# EAGLE design biosphereMonitor (EAGLE 9.6.2)

## Sheet 1 of 5: Microcontroller
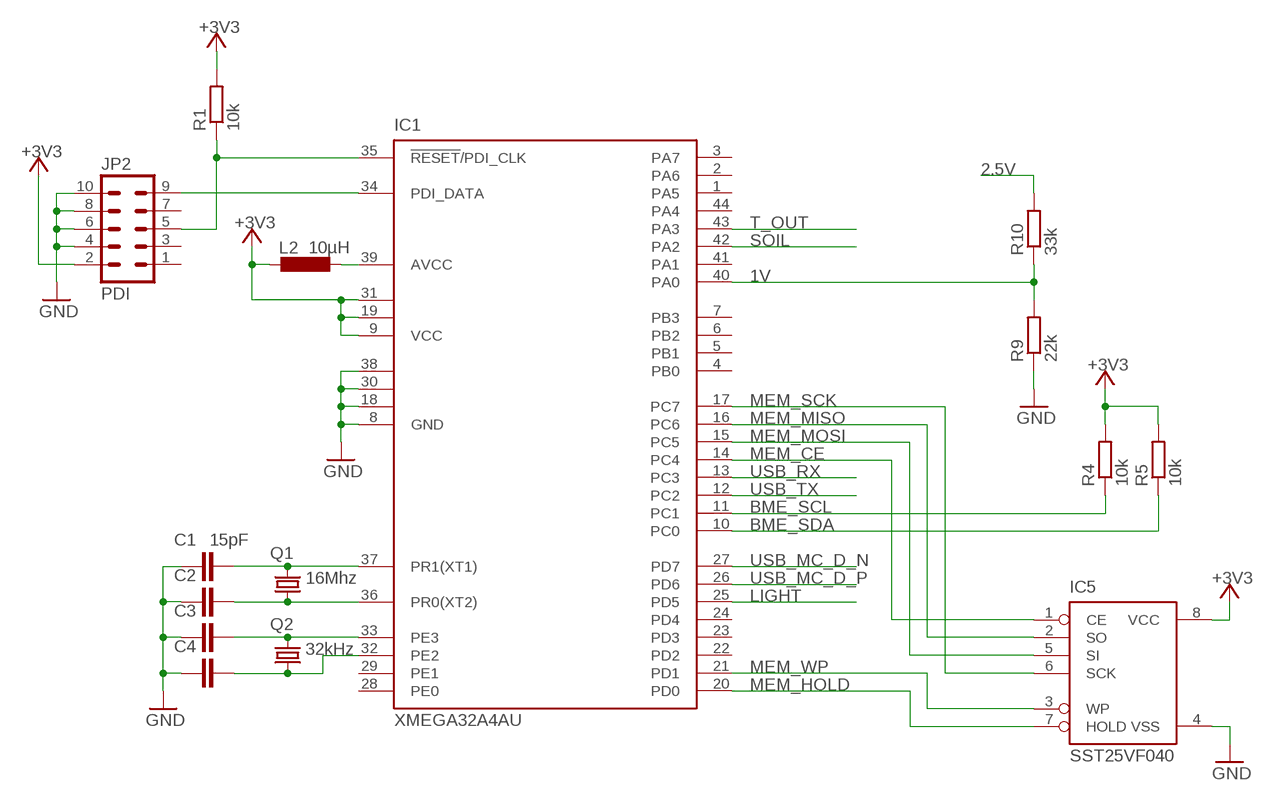
[diagram p0: schematic, sheet 1]

### Parts
C1  15pF  C-EUC0805  [C0805]
C2  15pF  C-EUC0805  [C0805]
C3  15pF  C-EUC0805  [C0805]
C4  15pF  C-EUC0805  [C0805]
IC1  XMEGA32A4AU  XMEGA16A4A  [TQFP44]
IC5  SST25VF040  SST25VF040SO08W  [SO08-208]
JP2  PDI  ML10L  [ML10L]
L2  10µH  L-EUL2012C  [L2012C]
Q1  16Mhz  CRYSTALSM49  [SM49]
Q2  32kHz  MQ_CRYSTALMS1V  [MS1V]
R1  10k  R-EU_R0805  [R0805]
R4  10k  R-EU_R0805  [R0805]
R5  10k  R-EU_R0805  [R0805]
R9  22k  R-EU_R0805  [R0805]
R10  33k  R-EU_R0805  [R0805]

### Nets
1V: IC1.40(PA0) R9.2 R10.1
2.5V: R10.2 ; also sheet 2
+3V3: IC1.9(VCC) IC1.19(VCC1) IC1.31(VCC2) IC5.8(VCC) JP2.2 L2.1 R1.2 R4.2 R5.2 ; also sheet 2,3,5
AVCC: IC1.39(AVCC) L2.2
BME_SCL: IC1.11(PC1) R4.1 ; also sheet 5
BME_SDA: IC1.10(PC0) R5.1 ; also sheet 5
GND: C1.1 C2.1 C3.1 C4.1 IC1.8(GND) IC1.18(GND1) IC1.30(GND2) IC1.38(GND3) IC5.4(VSS) JP2.4 JP2.6 JP2.8 JP2.10 R9.1 ; also sheet 2,3,4,5
LIGHT: IC1.25(PD5) ; also sheet 4
MEM_CE: IC1.14(PC4) IC5.1(CE)
MEM_HOLD: IC1.20(PD0) IC5.7(HOLD)
MEM_MISO: IC1.16(PC6) IC5.2(SO)
MEM_MOSI: IC1.15(PC5) IC5.5(SI)
MEM_SCK: IC1.17(PC7) IC5.6(SCK)
MEM_WP: IC1.21(PD1) IC5.3(WP)
N$1: IC1.35(!RESET!/PDI_CLK) JP2.5 R1.1
N$2: IC1.34(PDI_DATA) JP2.9
N$3: C1.2 IC1.37(PR1(XT1)) Q1.2
N$4: C2.2 IC1.36(PR0(XT2)) Q1.1
N$5: C3.2 IC1.33(PE3) Q2.Q1
N$6: C4.2 IC1.32(PE2) Q2.Q2
SOIL: IC1.42(PA2) ; also sheet 5
T_OUT: IC1.43(PA3) ; also sheet 4
USB_MC_D_N: IC1.27(PD7) ; also sheet 3
USB_MC_D_P: IC1.26(PD6) ; also sheet 3
USB_RX: IC1.13(PC3) ; also sheet 3
USB_TX: IC1.12(PC2) ; also sheet 3
Unconnected: IC1.1(PA5) IC1.2(PA6) IC1.3(PA7) IC1.4(PB0) IC1.5(PB1) IC1.6(PB2) IC1.7(PB3) IC1.22(PD2) IC1.23(PD3) IC1.24(PD4) IC1.28(PE0) IC1.29(PE1) IC1.41(PA1) IC1.44(PA4) JP2.1 JP2.3 JP2.7

## Sheet 2 of 5: Power
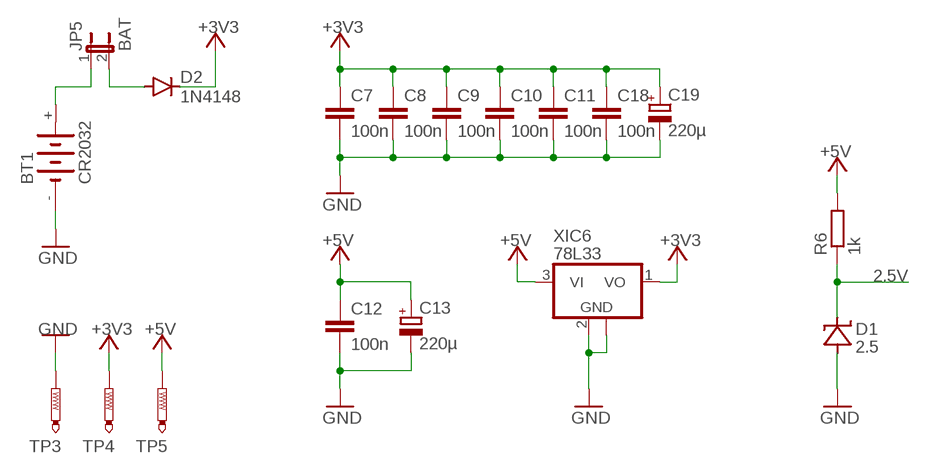
[diagram p1: schematic, sheet 2]

### Parts
BT1  CR2032  [CR2032]
C7  100n  C-EUC0805  [C0805]
C8  100n  C-EUC0805  [C0805]
C9  100n  C-EUC0805  [C0805]
C10  100n  C-EUC0805  [C0805]
C11  100n  C-EUC0805  [C0805]
C12  100n  C-EUC0805  [C0805]
C13  220µ  CPOL-EUG  [PANASONIC_G]
C18  100n  C-EUC0805  [C0805]
C19  220µ  CPOL-EUG  [PANASONIC_G]
D1  2.5  LM4040  [SOT23]
D2  1N4148  DIODE-MINIMELF  [MINIMELF]
JP5  BAT  JP1E  [JP1]
R6  1k  R-EU_R0805  [R0805]
TP3  PTR1B2,54  [B2,54]
TP4  PTR1B2,54  [B2,54]
TP5  PTR1B2,54  [B2,54]
XIC6  78L33  78L05F  [SOT89]

### Nets
2.5V: D1.1(C) R6.1 ; also sheet 1
+3V3: C7.2 C8.2 C9.2 C10.2 C11.2 C18.2 C19.+ D2.C TP4.TP XIC6.1(VO) ; also sheet 1,3,5
+5V: C12.2 C13.+ R6.2 TP5.TP XIC6.3(VI) ; also sheet 3,4,5
GND: BT1.- C7.1 C8.1 C9.1 C10.1 C11.1 C12.1 C13.- C18.1 C19.- D1.2(A) TP3.TP XIC6.2(GND) XIC6.2@1(GND) ; also sheet 1,3,4,5
N$26: BT1.+ JP5.1
N$27: D2.A JP5.2

## Sheet 3 of 5: USB UART
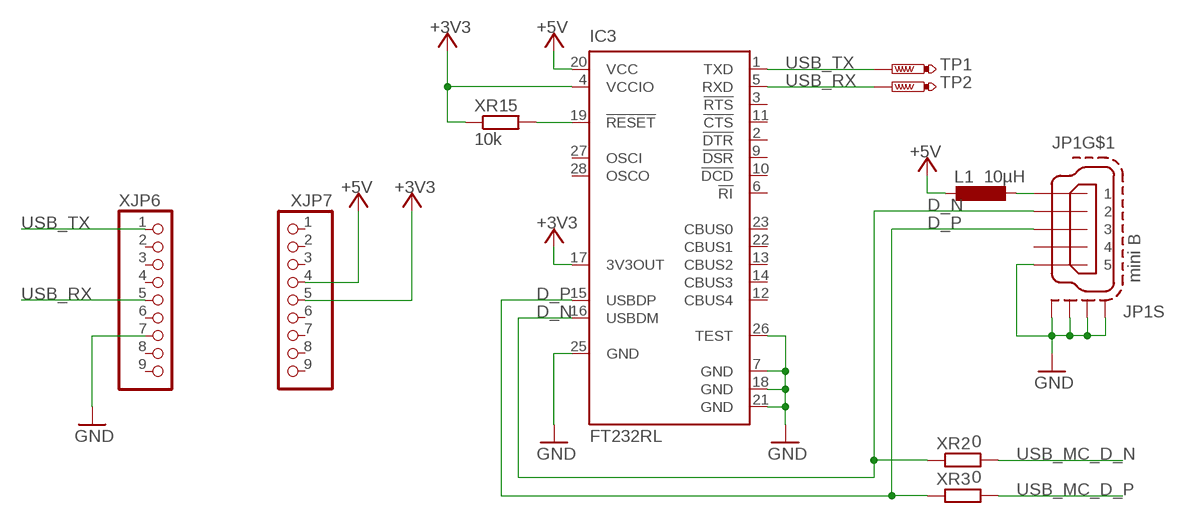
[diagram p2: schematic, sheet 3]

### Parts
IC3  FT232RL  [SSOP28]
JP1  mini B  MINI-USB-SCHIELD-32005-301  [32005-301]
L1  10µH  L-EUL2012C  [L2012C]
TP1  PTR1B2,54  [B2,54]
TP2  PTR1B2,54  [B2,54]
XJP6  PINHD-1X9  [1X09]
XJP7  PINHD-1X9  [1X09]
XR2  0  R-EU_R0805  [R0805]
XR3  0  R-EU_R0805  [R0805]
XR15  10k  R-EU_R0805  [R0805]

### Nets
+3V3: IC3.4(VCCIO) IC3.17(3V3OUT) XJP7.5 XR15.1 ; also sheet 1,2,5
+5V: IC3.20(VCC) L1.1 XJP7.4 ; also sheet 2,4,5
D_N: IC3.16(USBDM) JP1.2 XR2.1
D_P: IC3.15(USBDP) JP1.3 XR3.1
GND: IC3.7(GND) IC3.18(GND) IC3.21(GND) IC3.25(GND) IC3.26(TEST) JP1.5 JP1.M1(S:S1) JP1.M2(S:S2) JP1.M3(S:S3) JP1.M4(S:S4) XJP6.7 ; also sheet 1,2,4,5
N$7: JP1.1 L1.2
N$28: IC3.19(!RESET) XR15.2
USB_MC_D_N: XR2.2 ; also sheet 1
USB_MC_D_P: XR3.2 ; also sheet 1
USB_RX: IC3.5(RXD) TP2.TP XJP6.5 ; also sheet 1
USB_TX: IC3.1(TXD) TP1.TP XJP6.1 ; also sheet 1
Unconnected: IC3.2(!DTR) IC3.3(!RTS) IC3.6(!RI) IC3.9(!DSR) IC3.10(!DCD) IC3.11(!CTS) IC3.12(CBUS4) IC3.13(CBUS2) IC3.14(CBUS3) IC3.22(CBUS1) IC3.23(CBUS0) IC3.27(OSCI) IC3.28(OSCO) JP1.4 XJP6.2 XJP6.3 XJP6.4 XJP6.6 XJP6.8 XJP6.9 XJP7.1 XJP7.2 XJP7.3 XJP7.6 XJP7.7 XJP7.8 XJP7.9

## Sheet 4 of 5: Outside Sensors
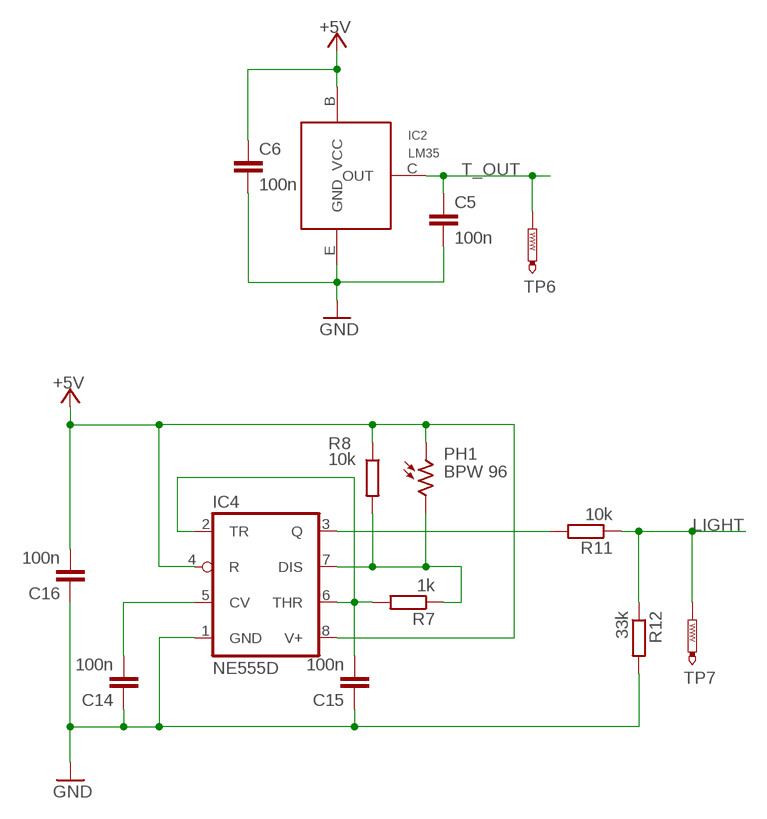
[diagram p3: schematic, sheet 4]

### Parts
C5  100n  C-EUC0805  [C0805]
C6  100n  C-EUC0805  [C0805]
C14  100n  C-EUC0805  [C0805]
C15  100n  C-EUC0805  [C0805]
C16  100n  C-EUC0805  [C0805]
IC2  LM35  [TO92-BCE]
IC4  NE555D  [SO08]
PH1  BPW 96  A1050_13  [T0-46-A10XX]
R7  1k  R-EU_R0805  [R0805]
R8  10k  R-EU_R0805  [R0805]
R11  10k  R-EU_R0805  [R0805]
R12  33k  R-EU_R0805  [R0805]
TP6  PTR1B2,54  [B2,54]
TP7  PTR1B2,54  [B2,54]

### Nets
+5V: C6.2 C16.1 IC2.B(VCC) IC4.4(R) IC4.8(V+) PH1.1 R8.1 ; also sheet 2,3,5
GND: C5.1 C6.1 C14.2 C15.2 C16.2 IC2.E(GND) IC4.1(GND) R12.2 ; also sheet 1,2,3,5
LIGHT: R11.1 R12.1 TP7.TP ; also sheet 1
N$21: IC4.7(DIS) PH1.2 R7.1 R8.2
N$22: C14.1 IC4.5(CV)
N$23: C15.1 IC4.2(TR) IC4.6(THR) R7.2
N$24: IC4.3(Q) R11.2
T_OUT: C5.2 IC2.C(OUT) TP6.TP ; also sheet 1

## Sheet 5 of 5: Inside Sensors
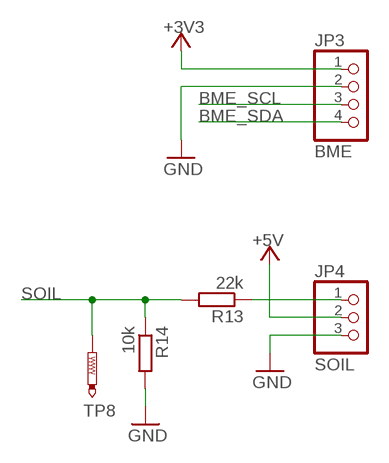
[diagram p4: schematic, sheet 5]

### Parts
JP3  BME  PINHD-1X4  [1X04]
JP4  SOIL  PINHD-1X3  [1X03]
R13  22k  R-EU_R0805  [R0805]
R14  10k  R-EU_R0805  [R0805]
TP8  PTR1B2,54  [B2,54]

### Nets
+3V3: JP3.1 ; also sheet 1,2,3
+5V: JP4.2 ; also sheet 2,3,4
BME_SCL: JP3.3 ; also sheet 1
BME_SDA: JP3.4 ; also sheet 1
GND: JP3.2 JP4.3 R14.2 ; also sheet 1,2,3,4
N$25: JP4.1 R13.1
SOIL: R13.2 R14.1 TP8.TP ; also sheet 1

## Library data of the parts
BT1 = Tjarks_Bauteile (1):CR2032
C1-C12 C14-C16 C18 = rcl:C-EU: CAPACITOR, European symbol; SPICEPREFIX: C
C13 C19 = rcl:CPOL-EU: POLARIZED CAPACITOR, European symbol; SPICEPREFIX: C
D1 = Tjarks_Bauteile (1):LM4040
D2 = diode:DIODE-: DIODE
IC1 = atmel:XMEGA16A4: MICROCONTROLLER Features High-performance, Low-power 8/16-bit AVR XMEGA Microcontroller Non-Volatile Program and Data Memories - 16 KB - 128 KB of In-System Self-Programmable Flash - 4 KB - 8 KB Boot Code Section with Independent Lock Bits - 1 KB - 2 KB EEPROM - 2 KB - 8 KB Internal SRAM Peripheral Features - Four-channel DMA Controller with support for external requests - Eight-channel Event System - Five 16-bit Timer/Counters Three Timer/Counters with 4 Output Compare or Input Capture channels Two Timer/Counters with 2 Output Compare or Input Capture channels High-Resolution Extensions on all Timer/Counters Advanced Waveform Extension on one Timer/Counter - Five USARTs IrDA Extension on one USART - Two Two-Wire Interfaces with dual address match (I2C and SMBus compatible) - Two SPIs (Serial Peripheral Interfaces) peripherals - AES and DES Crypto Engine - 16-bit Real Time Counter with Separate Oscillator - One Twelve-channel, 12-bit, 2 Msps Analog to Digital Converter - One Two-channel, 12-bit, 1 Msps Digital to Analog Converter - Two Analog Comparators with Window compare function - External Interrupts on all General Purpose I/O pins - Programmable Watchdog Timer with Separate On-chip Ultra Low Power Oscillator Special Microcontroller Features - Power-on Reset and Programmable Brown-out Detection - Internal and External Clock Options with PLL - Programmable Multi-level Interrupt Controller - Sleep Modes: Idle, Power-down, Standby, Power-save, Extended Standby - Advanced Programming, Test and Debugging Interfaces PDI (Program and Debug Interface) for programming, test and debugging I/O and Packages - 34 Programmable I/O Lines - 44 - lead TQFP - 44 - pad VQFN/QFN - 49 - ball VFBGA Operating Voltage - 1.6 - 3.6V Speed performance - 0 - 12 MHz @ 1.6 - 3.6V - 0 - 32 MHz @ 2.7 - 3.6V Drawn by Dipl.-Ing. (FH) Robert Siegler Created: 27.05.09; OC_FARNELL: unknown; OC_NEWARK: unknown
IC2 = Tjarks_Bauteile (1):LM35
IC3 = ftdichip:FT232R: Source: http://www.ftdichip.com/Documents/DataSheets/DS_FT232R_v104.pdf; MPN: FT232RL; OC_FARNELL: 1146032; OC_NEWARK: 91K9918
IC4 = linear:*555: TIMER
IC5 = Tjarks_Bauteile (1):SST25VF040
JP1 = con-cypressindustries:MINI-USB-SCHIELD-: MINI USB-B Conector Source: www.cypressindustries.com; OC_FARNELL: unknown; OC_NEWARK: unknown
JP2 = con-harting-ml:ML10: HARTING; OC_FARNELL: unknown; OC_NEWARK: unknown
JP3 = pinhead:PINHD-1X4: PIN HEADER
JP4 = pinhead:PINHD-1X3: PIN HEADER
JP5 = jumper:JP1E: JUMPER
L1 L2 = rcl:L-EU: INDUCTOR, European symbol; SPICEPREFIX: L
PH1 = photo-elements:A10: Sensor Robust Light Sensing Applications Outdoor Light Sensing Application Source: http://optoelectronics.perkinelmer.com/content/Datasheets/DTS_PhotocellsA1050.pdf
Q1 = crystal:CRYSTAL: CRYSTAL; OC_FARNELL: unknown; OC_NEWARK: unknown
Q2 = Tjarks_Bauteile (1):MQ_CRYSTAL
R1 R4-R14 XR2 XR3 XR15 = rcl:R-EU_: RESISTOR, European symbol; SPICEPREFIX: R
TP1-TP8 = testpad:PTR1: TEST PIN
XIC6 = linear:78L*: POSITOIV-VOLTAGE REGULATORS Output up to 100 mA Source: Datasheet <http://focus.ti.com/lit/ds/symlink/ua78l05.pdf>
XJP6 XJP7 = pinhead:PINHD-1X9: PIN HEADER

## Board
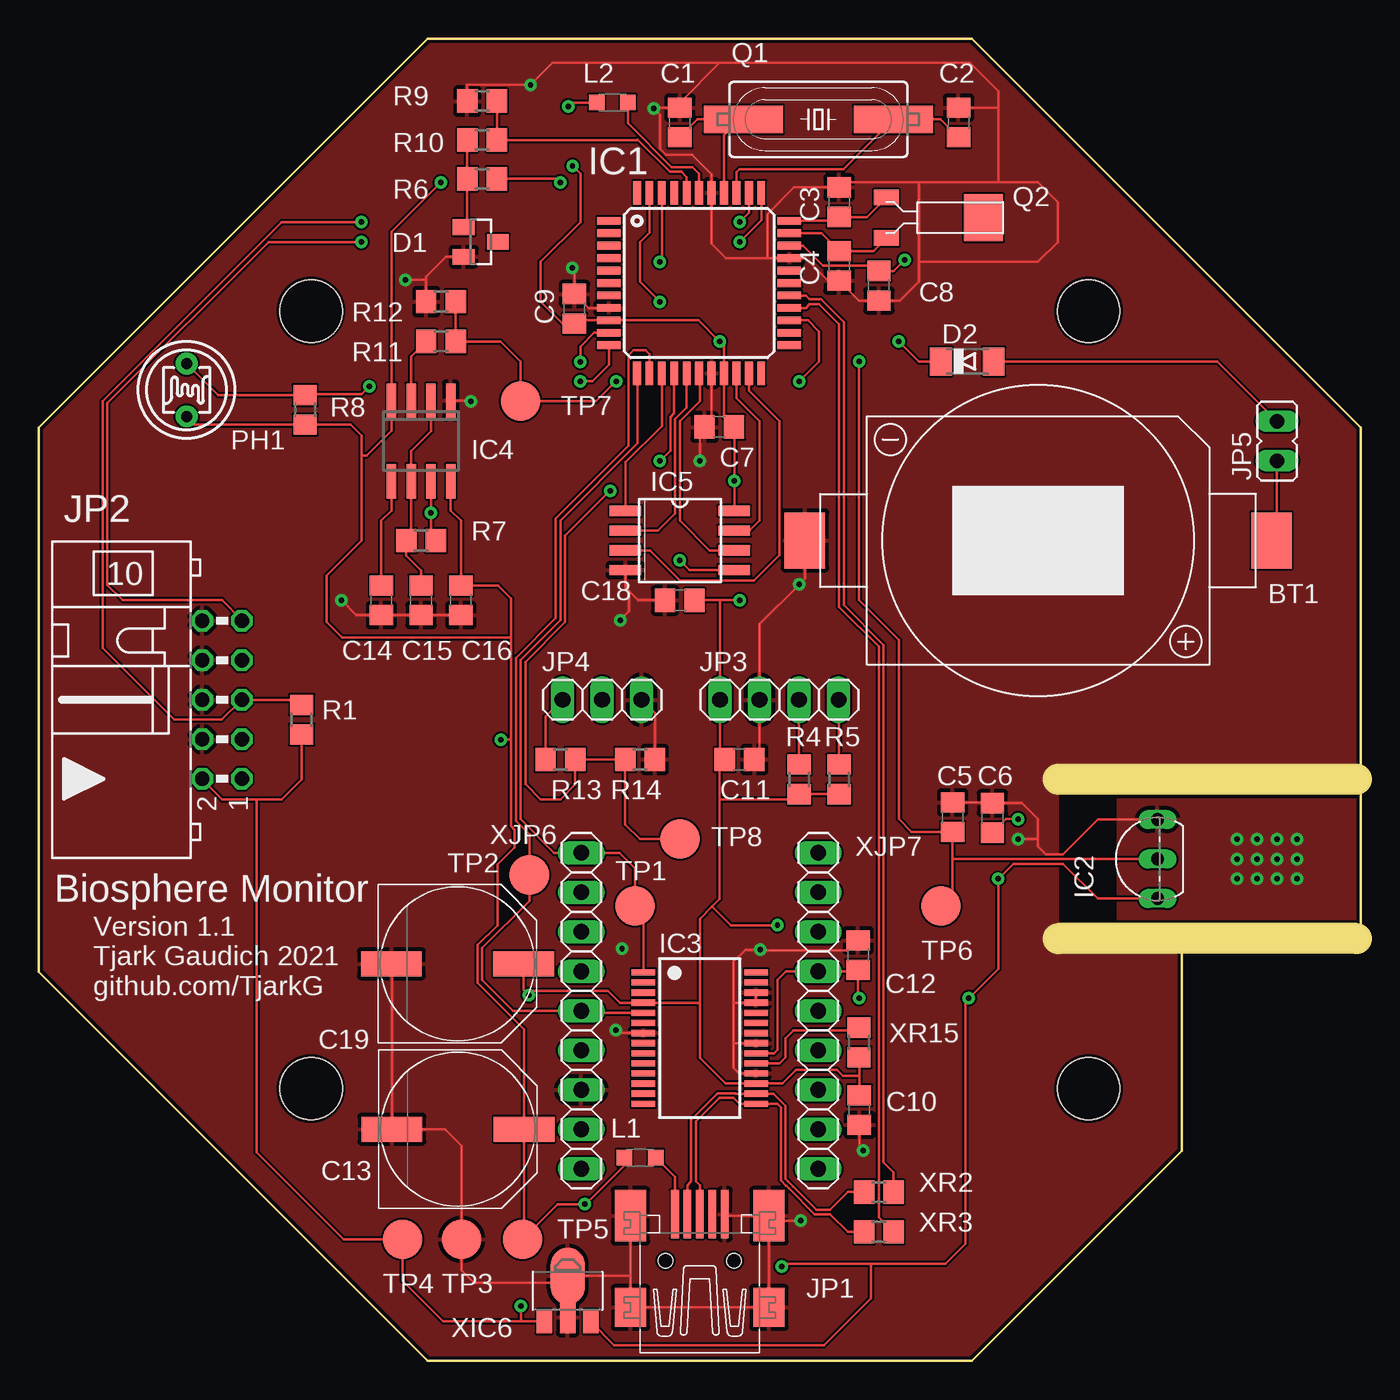
[diagram p5: board, top side]
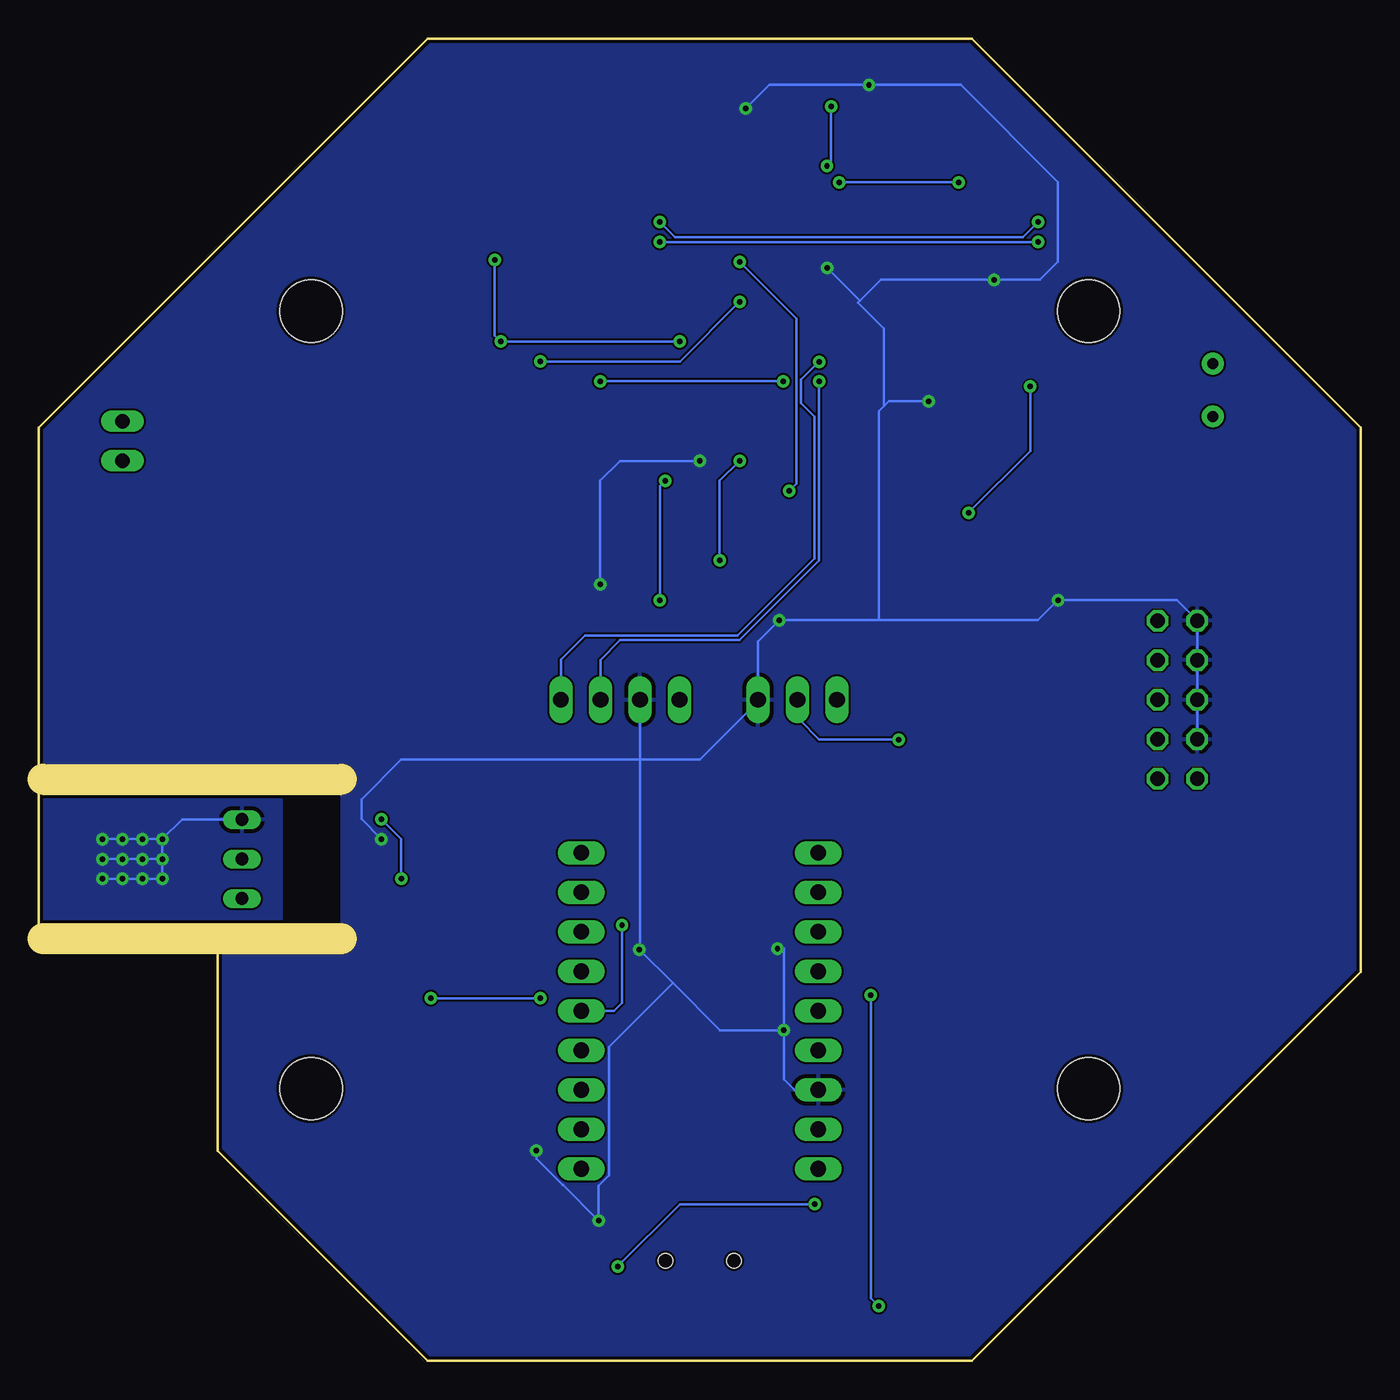
[diagram p6: board, bottom side, seen from below]

Size 85 x 85 mm. Coordinates in mm from the lower left corner, seen from the top.
Outline: 0,60 25,85 60,85 85,60 85,27 73.5,27 73.5,13.5 60,0 25,0 0,25 0,60
Copper layers (1*16): Top 0.035mm / dielectric 1.5mm / Bottom 0.035mm
Design rules "JLCPCB *": minimum track width 5mil, minimum drill 0.2mm, track to track 5mil, track to pad 0.2mm, pad to pad 5mil, via to via 10mil, smd to smd 5mil, copper to edge 0.2mm, drill to drill 0.5mm, minimum pad ring 0.13mm, minimum via ring 0.225mm, stop-mask expansion 0.05mm, vias tented up to drill 0mil, thermal gap 10mil
Holes 4 mm at 17.5,67.5 67.5,67.5 67.5,17.5 17.5,17.5
Milling: 2 lines

### Footprints (pad centres in the part's own frame; a part is rotated, then mirrored left to right if it is on the bottom)
CR2032 = smd 2.6 x 3.6: + 15,0; - -15,0
C0805 = smd 1.3 x 1.5: 1 -0.95,0; 2 0.95,0
PANASONIC_G = smd 3.9 x 1.6: + 4.25,0; - -4.25,0
SOT23 = smd 1 x 1.4: 1 -0.95,-1.1; 2 0.95,-1.1; 3 0,1.1
MINIMELF = smd 1.4 x 1.8: A 1.7,0; C -1.7,0
TQFP44 = smd 1.5 x 0.5: 1 -5.8,4; 2 -5.8,3.2; 3 -5.8,2.4; 4 -5.8,1.6; 5 -5.8,0.8; 6 -5.8,0; 7 -5.8,-0.8; 8 -5.8,-1.6; 9 -5.8,-2.4; 10 -5.8,-3.2; 11 -5.8,-4; 23 5.8,-4; 24 5.8,-3.2; 25 5.8,-2.4; 26 5.8,-1.6; 27 5.8,-0.8; 28 5.8,0; 29 5.8,0.8; 30 5.8,1.6; 31 5.8,2.4; 32 5.8,3.2; 33 5.8,4 | smd 0.5 x 1.5: 12 -4,-5.8; 13 -3.2,-5.8; 14 -2.4,-5.8; 15 -1.6,-5.8; 16 -0.8,-5.8; 17 0,-5.8; 18 0.8,-5.8; 19 1.6,-5.8; 20 2.4,-5.8; 21 3.2,-5.8; 22 4,-5.8; 34 4,5.8; 35 3.2,5.8; 36 2.4,5.8; 37 1.6,5.8; 38 0.8,5.8; 39 0,5.8; 40 -0.8,5.8; 41 -1.6,5.8; 42 -2.4,5.8; 43 -3.2,5.8; 44 -4,5.8
TO92-BCE = drill 0.813 long: B -2.54,0; C 0,0; E 2.54,0
SSOP28 = smd 0.4 x 1.5: 1 -4.225,-3.625; 2 -3.575,-3.625; 3 -2.925,-3.625; 4 -2.275,-3.625; 5 -1.625,-3.625; 6 -0.975,-3.625; 7 -0.325,-3.625; 8 0.325,-3.625; 9 0.975,-3.625; 10 1.625,-3.625; 11 2.275,-3.625; 12 2.925,-3.625; 13 3.575,-3.625; 14 4.225,-3.625; 15 4.225,3.625; 16 3.575,3.625; 17 2.925,3.625; 18 2.275,3.625; 19 1.625,3.625; 20 0.975,3.625; 21 0.325,3.625; 22 -0.325,3.625; 23 -0.975,3.625; 24 -1.625,3.625; 25 -2.275,3.625; 26 -2.925,3.625; 27 -3.575,3.625; 28 -4.225,3.625
SO08 = smd 0.6 x 2.2: 1 -1.905,-2.6; 2 -0.635,-2.6; 3 0.635,-2.6; 4 1.905,-2.6; 5 1.905,2.6; 6 0.635,2.6; 7 -0.635,2.6; 8 -1.905,2.6
SO08-208 = smd 0.66 x 2.032: 1 -1.905,-3.498; 2 -0.635,-3.498; 3 0.635,-3.498; 4 1.905,-3.498; 5 1.905,3.498; 6 0.635,3.498; 7 -0.635,3.498; 8 -1.905,3.498
32005-301 = smd 3.1 x 0.5: 1 3,1.6; 2 3,0.8; 3 3,0; 4 3,-0.8; 5 3,-1.6 | smd 2.5 x 2: M1 -3,-4.45; M2 -3,4.45 | smd 3.3 x 2: M3 2.9,4.45; M4 2.9,-4.45 | hole 0.9: 0,2.2; 0,-2.2
ML10L = drill 0.914 octagon: 1 -5.08,-1.27; 2 -5.08,1.27; 3 -2.54,-1.27; 4 -2.54,1.27; 5 0,-1.27; 6 0,1.27; 7 2.54,-1.27; 8 2.54,1.27; 9 5.08,-1.27; 10 5.08,1.27
1X04 = drill 1.016 long: 1 -3.81,0; 2 -1.27,0; 3 1.27,0; 4 3.81,0
1X03 = drill 1.016 long: 1 -2.54,0; 2 0,0; 3 2.54,0
JP1 = drill 0.914 long: 1 0,-1.27; 2 0,1.27
L2012C = smd 1 x 1: 1 -1,0; 2 1,0
T0-46-A10XX = drill 0.7 pad 1.4: 1 -1.7,0; 2 1.7,0
SM49 = smd 5.08 x 1.778: 1 -4.826,0; 2 4.826,0
MS1V = smd 2.5 x 3: NC -6.25,0 | smd 1.6 x 1: Q1 0,-1.3; Q2 0,1.3
R0805 = smd 1.3 x 1.5: 1 -0.95,0; 2 0.95,0
B2,54 = smd 2.54 x 2.54: TP 0,0
SOT89 = smd 1 x 1.5: 1 -1.499,-1.981; 3 1.499,-1.981 | smd 1 x 2: 2 0,-1.727 | smd 2.2 x 3.7: 2@1 0,0.94
1X09 = drill 1.016 long: 1 -10.16,0; 2 -7.62,0; 3 -5.08,0; 4 -2.54,0; 5 0,0; 6 2.54,0; 7 5.08,0; 8 7.62,0; 9 10.16,0

### Placement (x,y rotation side)
BT1  64.26,52.74 0 top
C1  41.22,79.62 270 top
C2  59.14,79.62 270 top
C3  51.46,74.5 270 top
C4  51.46,70.4 90 top
C5  58.76,34.95 270 top
C6  61.32,34.9 270 top
C7  43.75,60.04 0 top
C8  54.02,69.12 90 top
C9  34.44,67.65 270 top
C10  52.76,16.11 90 top
C11  45.06,38.66 180 top
C12  52.68,26.08 270 top
C13  26.95,14.88 0 top
C14  22.02,48.9 270 top
C15  24.58,48.9 270 top
C16  27.14,48.9 270 top
C18  41.22,48.9 0 top
C19  26.92,25.52 0 top
D1  28.42,71.94 270 top
D2  59.7,64.26 0 top
IC1  42.46,69.3 0 top
IC2  71.94,32.26 90 top
IC3  42.5,20.74 270 top
IC4  24.58,59.14 180 top
IC5  41.22,52.74 270 top
JP1  42.5,6.42 90 top
JP2  11.78,42.5 90 top
JP3  47.62,42.5 0 top
JP4  36.22,42.5 0 top
JP5  79.62,59.14 0 top
L1  38.66,13.06 0 top
L2  36.88,80.9 0 top
PH1  9.5,62.42 90 top
Q1  50.13,79.82 180 top
Q2  54.5,73.5 180 top
R1  16.9,41.22 270 top
R4  48.9,37.38 270 top
R5  51.46,37.38 270 top
R6  28.5,76 0 top
R7  24.58,52.74 180 top
R8  17.12,61.14 90 top
R9  28.5,81 0 top
R10  28.5,78.5 180 top
R11  25.86,65.54 180 top
R12  25.86,68.1 180 top
R13  33.54,38.66 0 top
R14  38.66,38.66 0 top
TP1  38.34,29.23 0 top
TP2  31.54,31.23 0 top
TP3  27.18,7.81 0 top
TP4  23.38,7.81 0 top
TP5  31.1,7.81 0 top
TP6  58.02,29.23 0 top
TP7  30.98,61.7 0 top
TP8  41.22,33.54 0 top
XIC6  34,4.5 0 top
XJP6  34.88,22.5 270 top
XJP7  50.12,22.5 270 top
XR2  54.02,10.84 0 top
XR3  54.02,8.28 0 top
XR15  52.74,20.46 90 top

### Tracks (layer width: path | path; a pad name or v marks a point on that pad's centre or on a via)
1V
  Top 0.152: IC1.40 41.66,76.11 41.32,76.45 40.57,76.45 38.51,78.51 38.5,78.5 R10.1 R9.2
2.5V
  Top 0.152: D1.1 27.55,73.12 R6.1 R10.2
+3V3  (via drill 0.35)
  Top 0.152: JP2.2 10.51,37.37 11.78,36.1 14,36.1 | 14,36.1 15.62,36.1 16.9,37.38 R1.2 | IC1.31 49.14,71.7 50.44,70.4 53.69,70.4 C8.2 54.97,70.07 v55.68,70.79 | R5.2 R4.2 48.57,36.1 43.78,36.1 | 43.78,36.1 43.78,38.33 C11.2 43.81,38.96 JP3.1 43.81,48.87 43.78,48.9 | 43.78,36.1 43.78,29.7 43.29,29.21 | 43.29,29.21 42.5,28.42 42.5,22.92 | 42.5,22.92 42.5,19.46 44.15,17.82 IC3.17 47.81,17.82 48.69,18.69 51.33,18.69 51.72,18.31 52.76,18.31 | 42.5,22.92 42.4,23.02 IC3.4 37.38,23.02 36.61,23.78 31.79,23.78 31.78,23.78 v31.5,23.5 31.17,23.83 C19.+ | 43.78,48.9 v45.06,48.9 | 43.78,48.9 C18.2 | IC5.8 v44.72,56.58 44.72,60.02 C7.2 44.06,60.68 IC1.19 44.06,65.26 v43.78,65.54 42.42,66.9 IC1.9 34.64,66.9 C9.2 33.66,66.7 32.26,68.1 32.26,70.66 34.82,73.22 34.82,76.34 v34.32,76.84 | v55.3,65.54 56.58,64.26 D2.C | L2.1 34.31,80.9 v34.05,80.64 | XIC6.1 31,2.52 | 31,2.52 25.98,2.52 23.38,5.12 TP4.TP 19.59,7.81 14,13.4 14,36.1 | C10.2 52.76,18.31 | 52.76,18.31 52.76,19.49 XR15.1 | v47.5,28 44.5,28 43.29,29.21 | v31,3.5 31,2.52
  Bottom 0.152: v55.68,70.79 55.68,65.92 v55.3,65.54 v43.78,65.54 | v45.06,48.9 45.06,56.24 v44.72,56.58 | v34.05,80.64 34.05,77.11 v34.32,76.84 | XJP7.5 48,22.5 47.5,23 v47.5,28 | v31.5,23.5 31.5,4 v31,3.5
+5V  (via drill 0.35)
  Top 0.152: IC2.B 68.1,29.72 65.86,31.95 62.67,31.95 v61.7,30.98 61.7,25.2 v59.8,23.3 59.58,23.08 59.58,7.5 58.3,6.22 53.5,6.22 | IC4.8 26.48,54.67 27.14,54.02 C16.1 29.52,49.85 30.37,49 30.37,46.5 | PH1.1 10.03,60.19 R8.1 20.05,60.19 20.74,59.5 20.74,58.19 | 20.74,58.19 21.07,58.19 22.68,59.8 IC4.4 22.68,72.59 v25.86,75.78 | 20.74,58.19 20.74,52.74 18.5,50.5 18.5,47.5 19.5,46.5 30.37,46.5 | L1.1 37.66,12.56 35.16,10.06 v35.1,10.06 33.35,10.06 TP5.TP 31.2,7.91 C13.+ 31.2,21.3 28.22,24.28 28.22,26.72 29.5,28 29.5,31.9 30.6,33 30.6,34.14 30.37,34.37 30.37,39.94 | v33.54,75.78 33.32,76 R6.2 | C6.2 62.19,34.82 v62.98,34.82 | v52.74,23.3 52.68,23.36 52.68,25 | 52.68,25 C12.2 | 53.5,6.22 47.94,6.22 v47.78,6.06 | 30.37,46.5 30.37,39.94 | v29.7,39.94 30.37,39.94 | XIC6.3 35.5,2.5 37,1 50.5,1 53.5,4 53.5,6.22 | 52.68,25 52.64,25.04 XJP7.4 48.04,25.04 47.5,24.5 47.5,20 47.27,19.77 IC3.20
  Bottom 0.152: v25.86,75.78 v33.54,75.78 | v62.98,34.82 61.7,33.54 v61.7,30.98 | v59.8,23.3 v52.74,23.3 | v47.78,6.06 43.78,10.06 v35.1,10.06 | JP4.2 36.1,42.38 36.1,41.22 34.82,39.94 v29.7,39.94
AVCC
  Top 0.152: IC1.39 42.46,76.33 42.04,76.75 40.7,76.75 37.88,79.57 L2.2
BME_SCL  (via drill 0.35)
  Top 0.152: R4.1 JP3.3 | v34.82,62.98 35.6,62.98 36.66,64.04 IC1.11
  Bottom 0.152: JP3.3 48.89,45.07 47.62,46.34 39.94,46.34 34.82,51.46 v34.82,62.98
BME_SDA  (via drill 0.35)
  Top 0.152: R5.1 51.46,42.47 JP3.4 | v34.82,64.23 34.82,65.22 35.7,66.1 IC1.10
  Bottom 0.152: JP3.4 51.43,45.09 49.88,46.64 40.07,46.64 35.12,51.59 35.12,60.73 35.98,61.58 35.98,63.1 34.84,64.23 v34.82,64.23
D_N
  Top 0.152: JP1.2 41.7,11.27 41.95,11.52 41.95,15.5 43.61,17.16 43.65,17.16 43.66,17.18 43.9,17.18 | 43.9,17.18 | 43.9,17.18 44.79,17.18 44.8,17.16 IC3.16 47.23,17.16 48,16.39 48,11.7 48.17,11.53 48.18,11.53 48.51,11.2 48.51,11.19 50,9.7 50.88,9.7 52.02,10.84 XR2.1
D_P
  Top 0.152: JP1.3 42.5,11.27 42.25,11.52 42.25,15.37 43.78,16.9 | 43.78,16.9 44.67,16.9 45.05,16.52 IC3.15 47.48,16.52 47.72,16.28 47.72,11.58 48.06,11.25 48.23,11.08 49.88,9.42 50.88,9.42 52.02,8.28 XR3.1 | 43.78,16.9
GND  (via drill 0.35)
  Top 0.152: IC2.E 68.1,34.8 65.86,32.56 64.77,32.56 64.26,33.08 64.26,33.54 | C16.2 C15.2 C14.2 20.41,47.95 v19.46,48.9 | JP1.M4 JP1.M1 JP1.M2 38.05,5.5 | JP1.M4 44.2,9.32 JP1.5 | JP1.M3 38.05,5.5 | IC3.18 45.03,18.46 44.68,18.82 44.68,20.36 | IC3.21 44.73,20.41 44.68,20.36 | IC3.26 IC3.25 44.77,23.02 44.68,22.92 | 44.68,20.36 44.68,22.92 | C5.1 61.27,35.9 C6.1 63.23,35.85 64.26,34.82 64.26,33.54 | 64.26,33.54 v62.98,33.54 | IC3.7 37.27,21.07 v37.1,21.24 | R14.2 39.61,41.65 JP4.3 | C11.1 46.35,39 JP3.2 46.35,47.37 v48.9,49.92 49.26,50.28 BT1.- | C18.1 38.53,48.9 37.96,49.48 | IC5.4 37.72,49.71 37.96,49.48 | 37.96,49.48 37.96,48.2 v37.38,47.62 | R12.2 24.91,69.51 | 24.91,69.51 24.91,69.71 26.19,70.99 D1.2 | 24.91,69.51 v23.56,69.51 | IC1.18 43.26,60.5 C7.1 42.5,59.74 v42.5,57.86 | IC1.8 35.34,67.7 C9.1 34.44,70.28 v34.31,70.28 | IC4.1 27.74,61.74 v27.78,61.7 | 56.58,70.66 56.58,69.38 55.37,68.17 C8.1 52.74,68.17 C4.1 50.75,69.45 49.3,70.9 IC1.30 46.87,70.9 | 56.58,70.66 56.58,75.78 | 56.58,75.78 51.79,75.78 C3.1 48.57,75.45 46.85,73.73 46.85,70.92 46.87,70.9 | 56.58,70.66 64.26,70.66 65.54,71.94 65.54,74.5 64.26,75.78 61.7,75.78 | 61.7,75.78 56.58,75.78 | 43.78,83.46 41.22,80.9 C1.1 39.56,80.57 v39.56,80.52 39.94,80.13 39.94,77.94 40.32,77.56 42,77.56 43.26,76.3 IC1.38 43.26,71.82 44.18,70.9 46.87,70.9 | 43.78,83.46 59.89,83.46 61.7,81.65 61.7,80.52 | 61.7,80.52 61.7,75.78 | C2.1 61.65,80.57 61.7,80.52 | 43.78,83.46 33.04,83.46 v31.62,82.04 27.55,82.04 R9.1 | XIC6.2 34,5 | 34,5 XIC6.2@1 37.99,5.44 38.05,5.5 | C12.1 52.02,26.37 46.43,26.37 v46.38,26.43 45.43,26.43 44.68,25.68 44.68,22.92 | C10.1 52.76,13.74 v53,13.5
  Top 0.152: v49,9 47.27,9 JP1.M4 | 34,5 28,5 27.18,5.82 TP3.TP 27.18,13.82 26.12,14.88 C13.- 22.7,25.49 C19.-
  Bottom 0.152: v37.1,21.24 41.19,21.24 44.22,24.28 | 44.22,24.28 v46.38,26.43 46.35,26.45 46.35,38.66 | 46.35,38.66 JP3.2 | 46.35,38.66 42.5,38.66 38.76,42.4 JP4.3 38.76,46.24 v37.38,47.62 30.98,47.62 | v62.98,33.54 64.26,34.82 64.26,36.1 61.7,38.66 46.35,38.66 | 30.98,47.62 20.74,47.62 v19.46,48.9 11.83,48.9 JP2.10 JP2.8 JP2.6 JP2.4 | v27.78,61.7 30.34,61.7 30.66,61.38 | 30.66,61.38 30.98,61.06 30.98,47.62 | v34.31,70.28 32.2,68.16 | 30.66,61.38 30.66,66.37 32.32,68.04 32.2,68.16 | 32.2,68.16 30.85,69.51 v23.56,69.51 20.61,69.51 19.46,70.66 19.46,75.78 25.72,82.04 v31.62,82.04 38.03,82.04 v39.56,80.52 | v42.5,57.86 47.62,57.86 48.9,56.58 v48.9,49.92 | v37.1,21.24 37.1,26.5 v37.5,26.5 | XJP6.7 36.42,17.42 37.1,18.1 v37.1,21.24 | v53,13.5 53,12.99 51.31,11.3 51.3,11.3 v49,9 49,11.23 48.32,11.91 48.32,20.18 44.22,24.28 | IC2.E 75.8,34.8 v77.06,33.54 | v77.06,33.54 v78.34,33.54 v79.62,33.54 v80.9,33.54 | v80.9,30.98 v79.62,30.98 v78.34,30.98 v77.06,30.98 v77.06,32.26 | v80.9,32.26 v79.62,32.26 v78.34,32.26 v77.06,32.26 | v77.06,32.26 v77.06,33.54
  pour Top: 84.74,28.42 69.38,28.42 69.38,36.1 84.74,36.1 86.02,36.1 86.02,28.42
  pour Bottom: 69.38,36.1 86.02,36.1 86.02,28.42 69.38,28.42
  pour Bottom: -1.02,-1.02 -1.02,86.02 86.02,86.02 86.02,37.38 65.54,37.38 65.54,27.14 86.02,27.14 86.02,-1.02
  pour Top: -1.02,-1.02 -1.02,86.02 86.02,86.02 86.02,37.38 65.54,37.38 65.54,27.14 86.02,27.14 86.02,-1.02
LIGHT  (via drill 0.35)
  Top 0.152: R12.1 R11.1 29.7,65.54 30.98,64.26 TP7.TP 35.84,61.7 v37.12,62.98 | v48.9,62.98 50.18,64.26 50.18,66.18 49.46,66.9 IC1.25
  Bottom 0.152: v37.12,62.98 v48.9,62.98
MEM_CE
  Top 0.152: IC5.1 37.72,57.77 40.06,60.11 IC1.14
MEM_HOLD
  Top 0.152: IC5.7 45.7,53.38 46.34,54.02 46.34,60.42 44.86,61.9 IC1.20
MEM_MISO
  Top 0.152: IC1.16 41.66,61.29 40.91,60.55 40.91,54.48 39.81,53.38 IC5.2
MEM_MOSI  (via drill 0.35)
  Top 0.152: IC1.15 40.86,60.92 40.61,60.67 40.61,58.53 v39.94,57.86 | v41.22,51.46 41.84,50.84 IC5.5
  Bottom 0.152: v39.94,57.86 41.22,56.58 v41.22,51.46
MEM_SCK
  Top 0.152: IC1.17 42.5,63.46 42.5,61.7 41.22,60.42 41.22,54.02 43.13,52.11 IC5.6
MEM_WP
  Top 0.152: IC1.21 45.66,62.38 47.62,60.42 47.62,51.81 45.99,50.18 41.22,50.18 39.3,52.11 IC5.3
N$1  (via drill 0.35)
  Top 0.152: R1.1 16.57,42.5 JP2.5 11.77,41.22 8.71,41.22 4.1,45.83 4.1,61.7 15.62,73.22 v20.74,73.22 | IC1.35 45.66,73.82 v45.06,73.22
  Bottom 0.152: v45.06,73.22 44.09,72.25 21.71,72.25 v20.74,73.22
N$2  (via drill 0.35)
  Top 0.152: v45.06,71.94 46.46,73.34 IC1.34 | v20.74,71.94 14.77,71.94 4.41,61.57 4.41,49.88 5.38,48.9 11.78,48.9 13.05,47.63 JP2.9
  Bottom 0.152: v45.06,71.94 v20.74,71.94
N$3
  Top 0.152: Q1.2 45.06,79.82 | 45.06,79.82 42.37,79.82 C1.2 | IC1.37 44.06,78.82 45.06,79.82
N$4
  Top 0.152: C2.2 57.99,79.82 Q1.1 51.76,76.62 45.06,76.62 44.86,76.42 IC1.36
N$5
  Top 0.152: IC1.33 51.21,73.3 C3.2 53.25,73.55 Q2.Q1
N$6
  Top 0.152: IC1.32 50.31,72.5 C4.2 53.65,71.35 Q2.Q2
N$7
  Top 0.152: JP1.1 40.9,11.82 L1.2
N$21  (via drill 0.35)
  Top 0.152: IC4.7 v25.21,54.53 25.21,53.05 R7.1 | PH1.2 11.53,62.09 R8.2 17.17,62.14 20.74,62.14 v21.24,62.64
  Bottom 0.152: v21.24,62.64 21.24,58.51 v25.21,54.53
N$22
  Top 0.152: C14.1 22.02,54.02 22.68,54.67 IC4.5
N$23
  Top 0.152: C15.1 24.58,50.82 23.63,51.77 R7.2 23.95,53.05 IC4.6 23.95,58.5 25.21,59.77 IC4.2
N$24
  Top 0.152: IC4.3 23.95,64.58 R11.2
N$25
  Top 0.152: R13.1 32.59,41.41 JP4.1
N$26
  Top 0.152: BT1.+ 79.62,53.1 JP5.1
N$27
  Top 0.152: JP5.2 75.77,64.26 D2.A
N$28
  Top 0.152: IC3.19 47.62,19.11 48,19.5 48,20.74 48.52,21.25 52.58,21.25 XR15.2
SOIL  (via drill 0.35)
  Top 0.152: TP8.TP 38.66,33.54 37.71,34.49 R14.1 R13.2 34.49,37.05 33.54,36.1 32.26,36.1 31.29,37.08 31.29,44.93 33.84,47.49 33.84,53.05 v36.74,55.94 | v39.94,70.66 40.06,70.78 IC1.42
  Bottom 0.152: v36.74,55.94 36.28,56.4 36.28,67 v39.94,70.66
T_OUT  (via drill 0.35)
  Top 0.152: 58.76,32.26 C5.2 56.12,34 55.3,34.82 55.3,46.34 52.74,48.9 v52.74,64.26 | 58.76,32.26 58.76,29.97 TP6.TP | IC2.C 58.76,32.26 | IC1.43 39.26,72.54 38.66,71.94 38.66,69.38 v39.94,68.1
  Bottom 0.152: v39.94,68.1 43.78,64.26 v52.74,64.26
USB_MC_D_N
  Top 0.152: IC1.27 49.31,68.5 49.56,68.25 50.31,68.25 51.77,66.79 51.77,48.59 54.33,46.03 54.33,12.77 54.97,12.12 XR2.2
USB_MC_D_P
  Top 0.152: IC1.26 49.31,67.7 49.56,67.95 50.18,67.95 51.46,66.67 51.46,48.47 54.02,45.91 54.02,9.23 XR3.2
USB_RX
  Top 0.152: IC3.5 35.02,22.36 XJP6.5 30.5,22.5 28.5,24.5 28.5,26.53 31.54,29.57 TP2.TP 31.54,33.83 30.68,34.69 30.68,45.19 33.23,47.75 33.23,54.15 37.93,58.84 37.93,64.68 38.26,65 39,65 39.26,64.74 IC1.13
USB_TX
  Top 0.152: IC3.1 38.88,28.7 TP1.TP 38.34,31.66 37.34,32.66 XJP6.1 33.14,32.66 30.98,34.82 30.98,45.06 33.54,47.62 33.54,54.02 38.51,58.99 38.51,63.45 IC1.12

### Text on the board
tNames: Biosphere Monitor | Version 1.1 / Tjark Gaudich 2021 / github.com/TjarkG